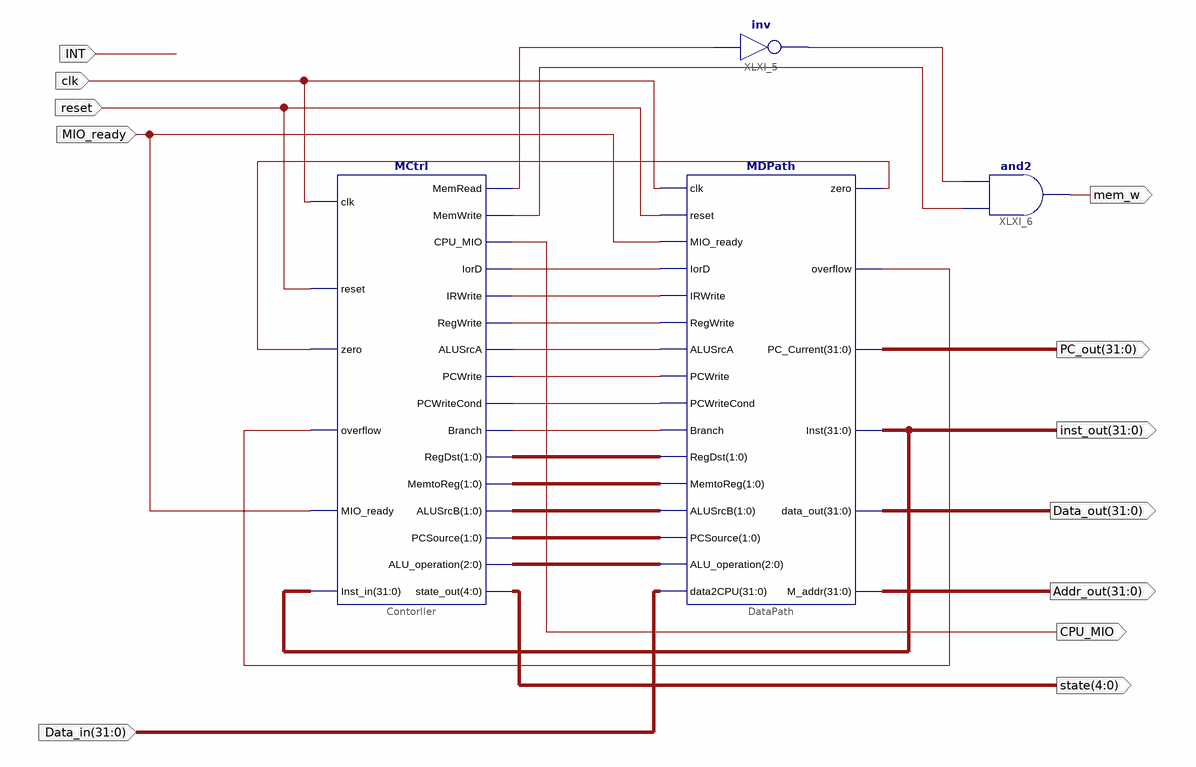
[diagram p0: schematic sheet 1]
// Xilinx ISE schematic MCPU.sch (kintex7) as structural Verilog: 4 symbols, 12 ports
module MCPU (
  input  clk,
  input  reset,
  input  MIO_ready,
  input  [31:0] Data_in,
  input  INT,
  output [31:0] inst_out,
  output CPU_MIO,
  output [31:0] PC_out,
  output [31:0] Data_out,
  output [31:0] Addr_out,
  output [4:0] state,
  output mem_w
);

  wire XLXN_7, XLXN_8, XLXN_9, XLXN_10, XLXN_11, XLXN_12, XLXN_13, XLXN_17, XLXN_18, XLXN_39, XLXN_41,
       XLXN_42;
  wire [1:0] XLXN_3, XLXN_4, XLXN_5, XLXN_6;
  wire [2:0] XLXN_2;

  not XLXI_5 (XLXN_42, XLXN_39);
  and XLXI_6 (mem_w, XLXN_41, XLXN_42);
  MDPath DataPath (
    .clk(clk), .reset(reset), .MIO_ready(MIO_ready), .IorD(XLXN_13), .IRWrite(XLXN_12), .RegWrite(XLXN_11),
    .ALUSrcA(XLXN_10), .PCWrite(XLXN_9), .PCWriteCond(XLXN_8), .Branch(XLXN_7), .RegDst(XLXN_6),
    .MemtoReg(XLXN_5), .ALUSrcB(XLXN_4), .PCSource(XLXN_3), .ALU_operation(XLXN_2), .data2CPU(Data_in),
    .zero(XLXN_17), .overflow(XLXN_18), .PC_Current(PC_out), .Inst(inst_out), .data_out(Data_out),
    .M_addr(Addr_out));
  MCtrl Contorller (
    .zero(XLXN_17), .overflow(XLXN_18), .MIO_ready(MIO_ready), .Inst_in(inst_out), .MemRead(XLXN_39),
    .MemWrite(XLXN_41), .CPU_MIO(CPU_MIO), .IorD(XLXN_13), .IRWrite(XLXN_12), .RegWrite(XLXN_11),
    .ALUSrcA(XLXN_10), .PCWrite(XLXN_9), .PCWriteCond(XLXN_8), .Branch(XLXN_7), .RegDst(XLXN_6),
    .MemtoReg(XLXN_5), .ALUSrcB(XLXN_4), .PCSource(XLXN_3), .ALU_operation(XLXN_2), .state_out(state),
    .reset(reset), .clk(clk));
endmodule
